# EAGLE design Nu6551 (EAGLE 7.7.0)
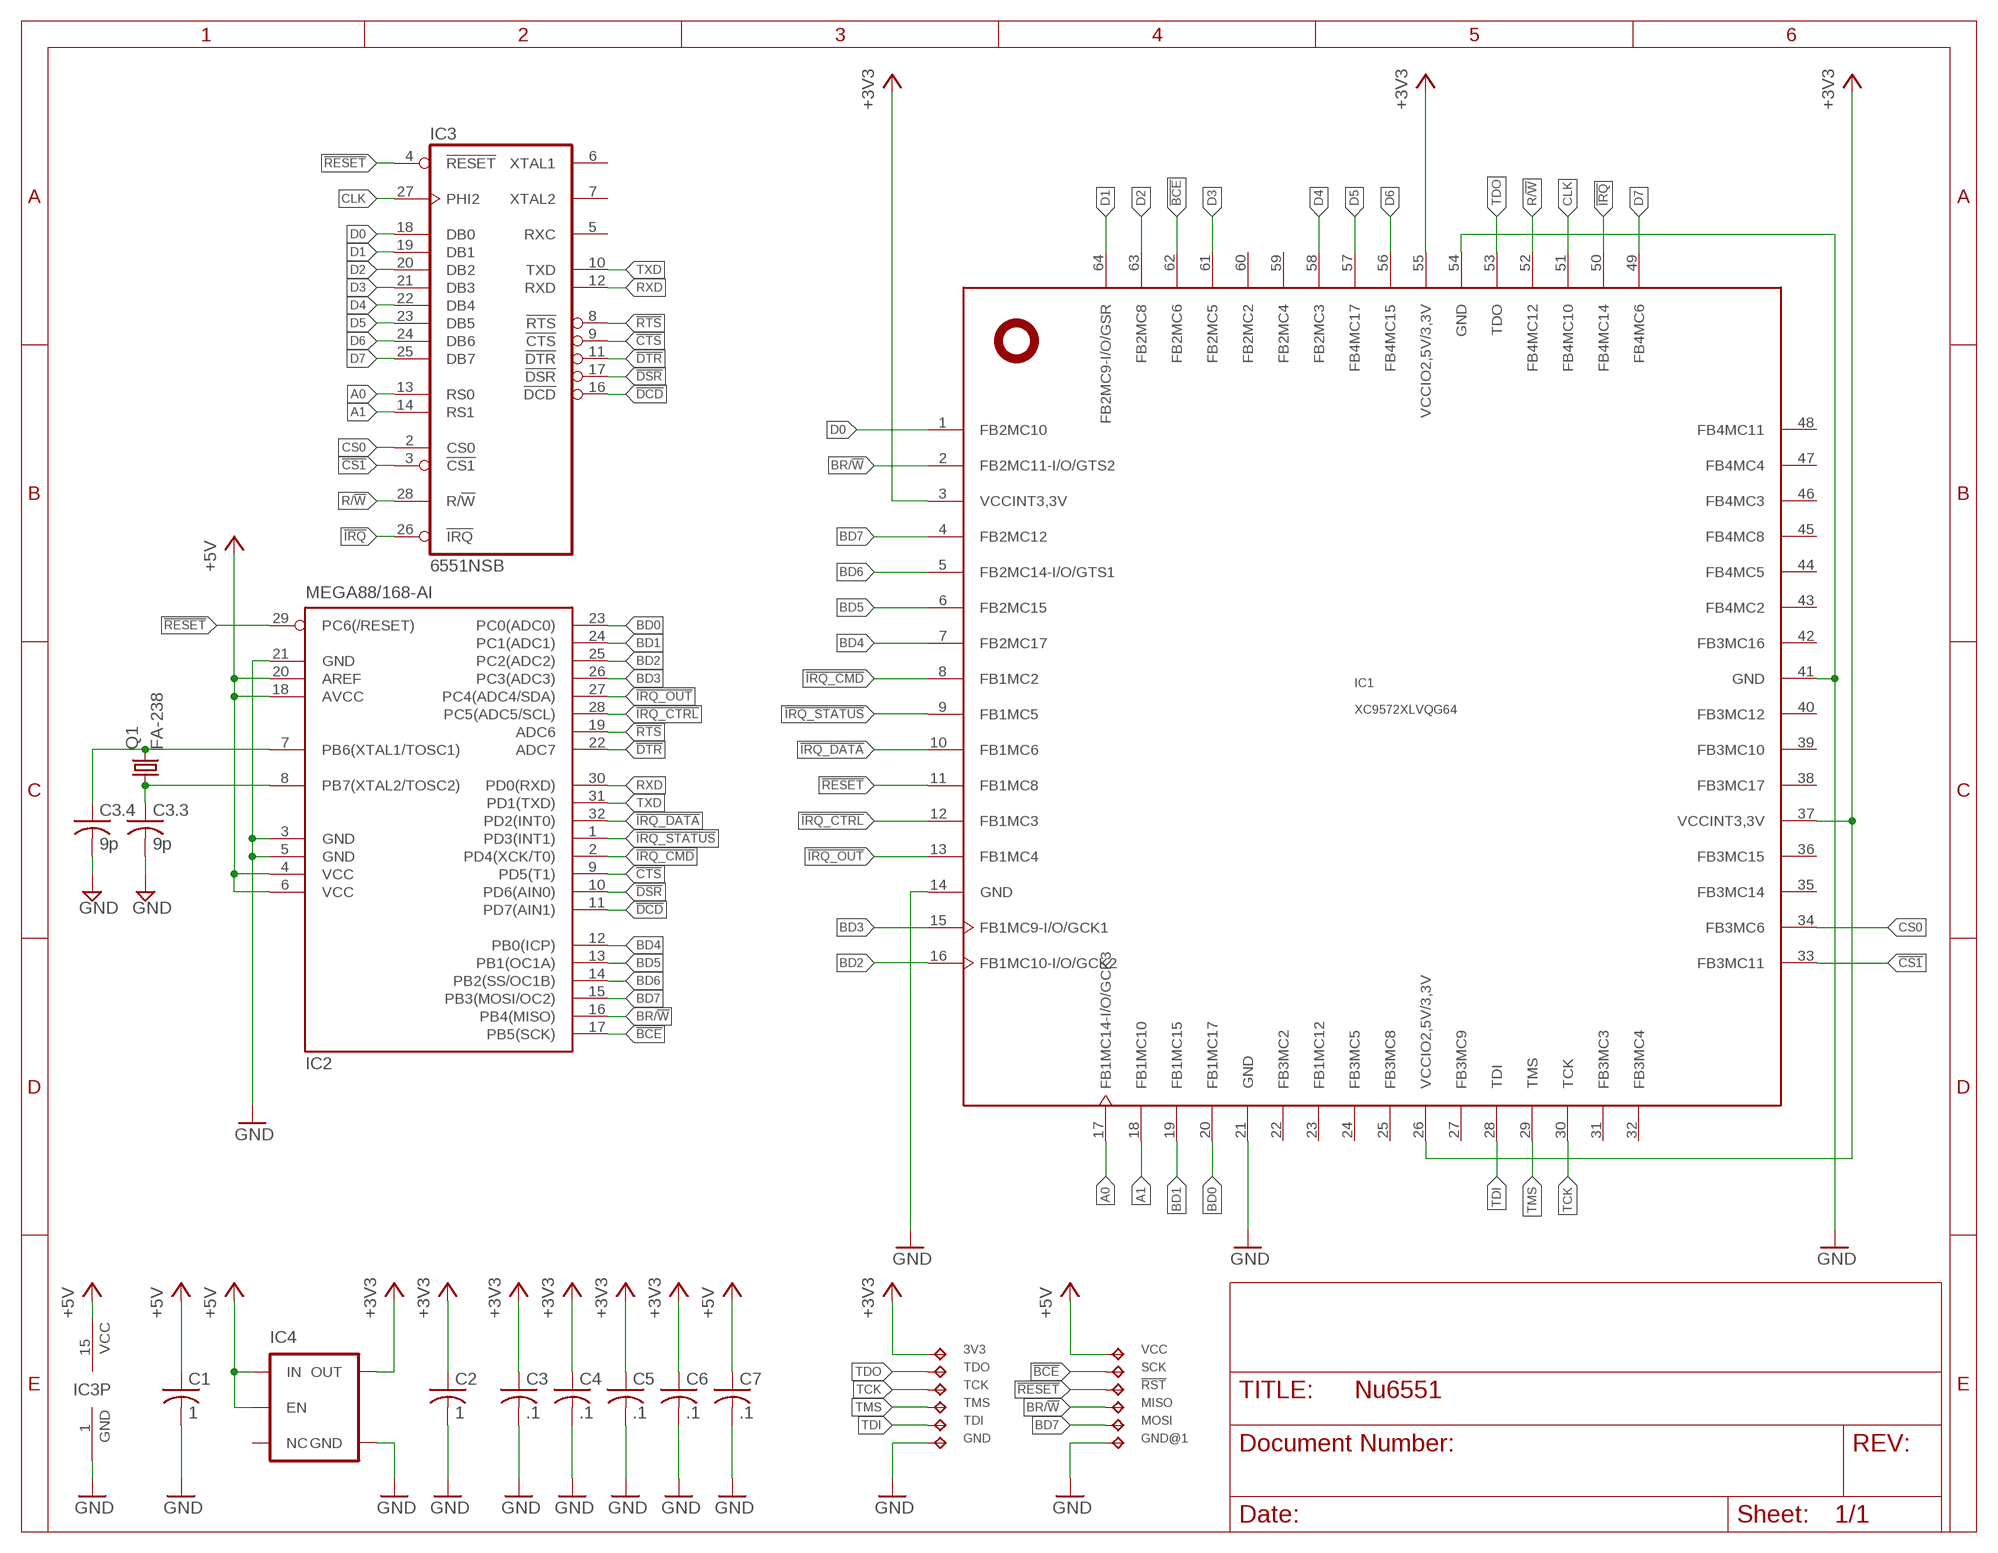
[diagram p0: schematic, sheet 1]

## Parts
3V3  TPTP10R  [TP10R]
!RST  TPTP10R  [TP10R]
C1  1  C-USC0402  [C0402]
C2  1  C-USC0402  [C0402]
C3  .1  C-USC0402  [C0402]
C3.3  9p  C-USC0402  [C0402]
C3.4  9p  C-USC0402  [C0402]
C4  .1  C-USC0402  [C0402]
C5  .1  C-USC0402  [C0402]
C6  .1  C-USC0402  [C0402]
C7  .1  C-USC0402  [C0402]
GND  TPTP10R  [TP10R]
GND@1  TPTP10R  [TP10R]
IC1  XC9572XLVQG64  [VQFP64]
IC2  MEGA88/168-AI  MEGA8-AI  [TQFP32-08]
IC3  6551NSB  [DIL28-SMD-REVERSE]
IC4  V_REG_TPS76433SOT23-5  [SOT23-5]
MISO  TPTP10R  [TP10R]
MOSI  TPTP10R  [TP10R]
Q1  FA-238  [ASE]
SCK  TPTP10R  [TP10R]
TCK  TPTP10R  [TP10R]
TDI  TPTP10R  [TP10R]
TDO  TPTP10R  [TP10R]
TMS  TPTP10R  [TP10R]
VCC  TPTP10R  [TP10R]

## Nets
!BCE: IC1.62(FB2MC6) IC2.17(PB5(SCK)) SCK.TP
!CS1: IC1.33(FB3MC11) IC3.3(!CS1)
!CTS: IC2.9(PD5(T1)) IC3.9(!CTS)
!DCD: IC2.11(PD7(AIN1)) IC3.16(!DCD)
!DSR: IC2.10(PD6(AIN0)) IC3.17(!DSR)
!DTR: IC2.22(ADC7) IC3.11(!DTR)
!IRQ: IC1.50(FB4MC14) IC3.26(!IRQ)
!IRQ_CMD: IC1.8(FB1MC2) IC2.2(PD4(XCK/T0))
!IRQ_CTRL: IC1.12(FB1MC3) IC2.28(PC5(ADC5/SCL))
!IRQ_DATA: IC1.10(FB1MC6) IC2.32(PD2(INT0))
!IRQ_OUT: IC1.13(FB1MC4) IC2.27(PC4(ADC4/SDA))
!IRQ_STATUS: IC1.9(FB1MC5) IC2.1(PD3(INT1))
!RESET: !RST.TP IC1.11(FB1MC8) IC2.29(PC6(/RESET)) IC3.4(!RESET)
!RTS: IC2.19(ADC6) IC3.8(!RTS)
+3V3: 3V3.TP C2.1 C3.1 C4.1 C5.1 C6.1 IC1.3(VCCINT3,3V) IC1.26(VCCIO2,5V/3,3V) IC1.37(VCCINT3,3V) IC1.55(VCCIO2,5V/3,3V) IC4.5(OUT)
+5V: C1.1 C7.1 IC2.4(VCC) IC2.6(VCC) IC2.18(AVCC) IC2.20(AREF) IC3.15(VCC) IC4.1(IN) IC4.3(EN) VCC.TP
A0: IC1.17(FB1MC14-I/O/GCK3) IC3.13(RS0)
A1: IC1.18(FB1MC10) IC3.14(RS1)
BD0: IC1.20(FB1MC17) IC2.23(PC0(ADC0))
BD1: IC1.19(FB1MC15) IC2.24(PC1(ADC1))
BD2: IC1.16(FB1MC10-I/O/GCK2) IC2.25(PC2(ADC2))
BD3: IC1.15(FB1MC9-I/O/GCK1) IC2.26(PC3(ADC3))
BD4: IC1.7(FB2MC17) IC2.12(PB0(ICP))
BD5: IC1.6(FB2MC15) IC2.13(PB1(OC1A))
BD6: IC1.5(FB2MC14-I/O/GTS1) IC2.14(PB2(SS/OC1B))
BD7: IC1.4(FB2MC12) IC2.15(PB3(MOSI/OC2)) MOSI.TP
BR/!W: IC1.2(FB2MC11-I/O/GTS2) IC2.16(PB4(MISO)) MISO.TP
CLK: IC1.51(FB4MC10) IC3.27(PHI2)
CS0: IC1.34(FB3MC6) IC3.2(CS0)
D0: IC1.1(FB2MC10) IC3.18(DB0)
D1: IC1.64(FB2MC9-I/O/GSR) IC3.19(DB1)
D2: IC1.63(FB2MC8) IC3.20(DB2)
D3: IC1.61(FB2MC5) IC3.21(DB3)
D4: IC1.58(FB2MC3) IC3.22(DB4)
D5: IC1.57(FB4MC17) IC3.23(DB5)
D6: IC1.56(FB4MC15) IC3.24(DB6)
D7: IC1.49(FB4MC6) IC3.25(DB7)
GND: C1.2 C2.2 C3.2 C3.3.2 C3.4.2 C4.2 C5.2 C6.2 C7.2 GND.TP GND@1.TP IC1.14(GND) IC1.21(GND) IC1.41(GND) IC1.54(GND) IC2.3(GND) IC2.5(GND) IC2.21(GND) IC3.1(GND) IC4.2(GND)
N$6: C3.3.1 IC2.8(PB7(XTAL2/TOSC2)) Q1.1
N$9: C3.4.1 IC2.7(PB6(XTAL1/TOSC1)) Q1.3
R/!W: IC1.52(FB4MC12) IC3.28(R/!W)
RXD: IC2.30(PD0(RXD)) IC3.12(RXD)
TCK: IC1.30(TCK) TCK.TP
TDI: IC1.28(TDI) TDI.TP
TDO: IC1.53(TDO) TDO.TP
TMS: IC1.29(TMS) TMS.TP
TXD: IC2.31(PD1(TXD)) IC3.10(TXD)
Unconnected: IC1.22(FB3MC2) IC1.23(FB1MC12) IC1.24(FB3MC5) IC1.25(FB3MC8) IC1.27(FB3MC9) IC1.31(FB3MC3) IC1.32(FB3MC4) IC1.35(FB3MC14) IC1.36(FB3MC15) IC1.38(FB3MC17) IC1.39(FB3MC10) IC1.40(FB3MC12) IC1.42(FB3MC16) IC1.43(FB4MC2) IC1.44(FB4MC5) IC1.45(FB4MC8) IC1.46(FB4MC3) IC1.47(FB4MC4) IC1.48(FB4MC11) IC1.59(FB2MC4) IC1.60(FB2MC2) IC3.5(RXC) IC3.6(XTAL1) IC3.7(XTAL2) IC4.4(NC)

## Power pins joined to a net without a drawn wire
GND: Q1.2(GND) Q1.4(GND)

## Library data of the parts
3V3 !RST GND GND@1 MISO MOSI SCK TCK TDI TDO TMS VCC = testpad:TP: Test pad
C1 C2 = resistor:C-US: CAPACITOR, American symbol
C3 C3.3 C3.4 C4-C7 = rcl:C-US: CAPACITOR, American symbol
IC1 = xilinx_xc95XXXxl:XC9572XLVQG64
IC2 = atmel:MEGA8: MICROCONTROLLER 8 Kbytes FLASH, 1 kbytes SRAM, 512 bytes EEPROM, USART, 6-channel 10 bit ADC, 2-channel 8 bit ADC Pin compatible with Atmega48, ATMega88, ATMega168 Source: avr.lbr; MPN: ATMEGA8-16AU; OC_FARNELL: 9171371; OC_NEWARK: 73M8863
IC3 = commodore:65*51: ACIA. Capable of RS-232
IC4 = SparkFun:V_REG_TPS76433: Voltage Regulator Older TI part. LDO 150mA regulator. No output by-pass cap option. See V_REG_LDO for a better part.
Q1 = crystal-jlb:FA-238

## Board
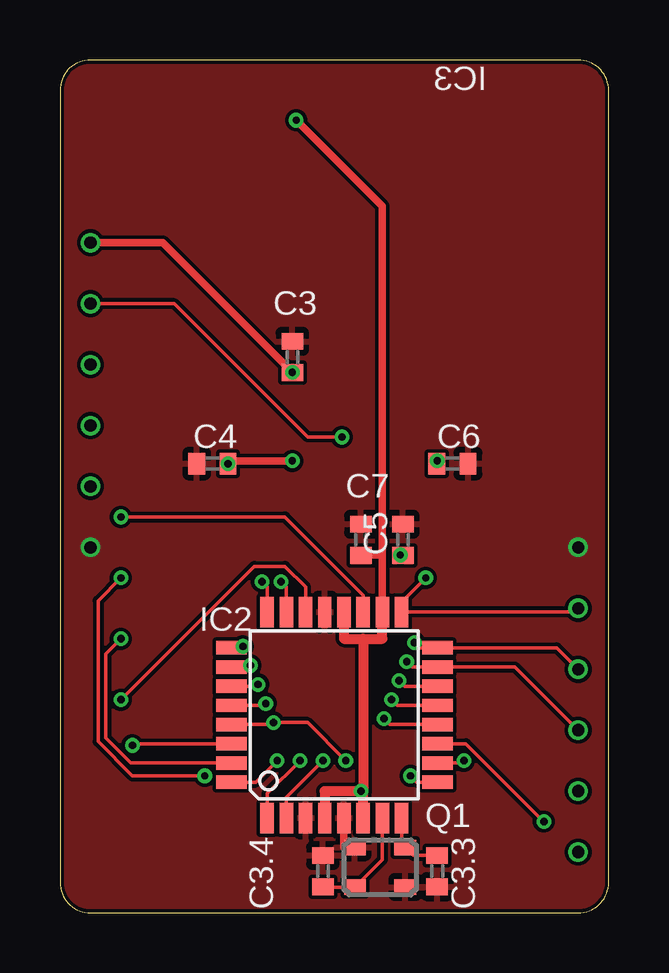
[diagram p1: board, top side]
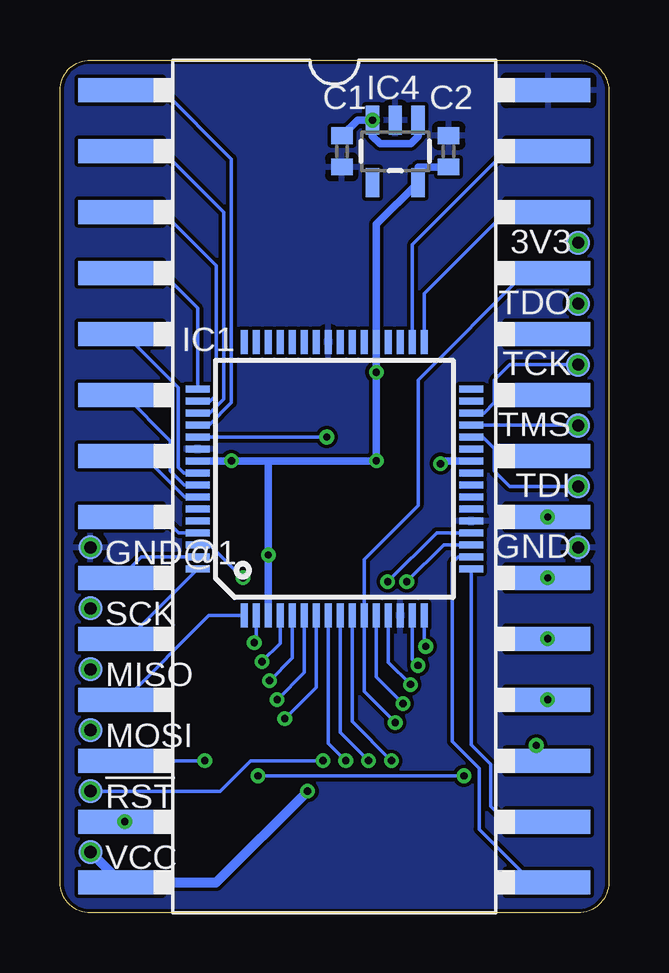
[diagram p2: board, bottom side, seen from below]

Size 22.86 x 35.56 mm. Coordinates in mm from the lower left corner, seen from the top.
Outline: 0,34.29 0,1.27 arc90 1.27,0 21.59,0 arc90 22.86,1.27 22.86,34.29 arc90 21.59,35.56 1.27,35.56 arc90 0,34.29
Copper layers (1*16): Top 0.035mm / dielectric 1.5mm / Bottom 0.035mm
Design rules "hackvana *": minimum track width 6mil, minimum drill 0.3mm, track to track 6mil, track to pad 6mil, pad to pad 6mil, via to via 6mil, smd to smd 0mil, copper to edge 6mil, drill to drill 6mil, minimum pad ring 10mil, minimum via ring 6mil, stop-mask expansion 2mil, vias tented up to drill 100mil, thermal gap 10mil

### Footprints (pad centres in the part's own frame; a part is rotated, then mirrored left to right if it is on the bottom)
TP10R = smd 1 x 1: TP 0,0
C0402 = smd 0.7 x 0.9: 1 -0.65,0; 2 0.65,0
VQFP64 = smd 1 x 0.3: 1 -5.7,3.75; 2 -5.7,3.25; 3 -5.7,2.75; 4 -5.7,2.25; 5 -5.7,1.75; 6 -5.7,1.25; 7 -5.7,0.75; 8 -5.7,0.25; 9 -5.7,-0.25; 10 -5.7,-0.75; 11 -5.7,-1.25; 12 -5.7,-1.75; 13 -5.7,-2.25; 14 -5.7,-2.75; 15 -5.7,-3.25; 16 -5.7,-3.75; 33 5.7,-3.75; 34 5.7,-3.25; 35 5.7,-2.75; 36 5.7,-2.25; 37 5.7,-1.75; 38 5.7,-1.25; 39 5.7,-0.75; 40 5.7,-0.25; 41 5.7,0.25; 42 5.7,0.75; 43 5.7,1.25; 44 5.7,1.75; 45 5.7,2.25; 46 5.7,2.75; 47 5.7,3.25; 48 5.7,3.75 | smd 0.3 x 1: 17 -3.75,-5.7; 18 -3.25,-5.7; 19 -2.75,-5.7; 20 -2.25,-5.7; 21 -1.75,-5.7; 22 -1.25,-5.7; 23 -0.75,-5.7; 24 -0.25,-5.7; 25 0.25,-5.7; 26 0.75,-5.7; 27 1.25,-5.7; 28 1.75,-5.7; 29 2.25,-5.7; 30 2.75,-5.7; 31 3.25,-5.7; 32 3.75,-5.7; 49 3.75,5.7; 50 3.25,5.7; 51 2.75,5.7; 52 2.25,5.7; 53 1.75,5.7; 54 1.25,5.7; 55 0.75,5.7; 56 0.25,5.7; 57 -0.25,5.7; 58 -0.75,5.7; 59 -1.25,5.7; 60 -1.75,5.7; 61 -2.25,5.7; 62 -2.75,5.7; 63 -3.25,5.7; 64 -3.75,5.7
TQFP32-08 = smd 1.27 x 0.559: 1 -4.293,2.8; 2 -4.293,2; 3 -4.293,1.2; 4 -4.293,0.4; 5 -4.293,-0.4; 6 -4.293,-1.2; 7 -4.293,-2; 8 -4.293,-2.8; 17 4.293,-2.8; 18 4.293,-2; 19 4.293,-1.2; 20 4.293,-0.4; 21 4.293,0.4; 22 4.293,1.2; 23 4.293,2; 24 4.293,2.8 | smd 0.559 x 1.27: 9 -2.8,-4.293; 10 -2,-4.293; 11 -1.2,-4.293; 12 -0.4,-4.293; 13 0.4,-4.293; 14 1.2,-4.293; 15 2,-4.293; 16 2.8,-4.293; 25 2.8,4.293; 26 2,4.293; 27 1.2,4.293; 28 0.4,4.293; 29 -0.4,4.293; 30 -1.2,4.293; 31 -2,4.293; 32 -2.8,4.293
DIL28-SMD-REVERSE = smd 1 x 3.5 bottom: 1 -16.51,-8.92; 2 -13.97,-8.92; 3 -11.43,-8.92; 4 -8.89,-8.92; 5 -6.35,-8.92; 6 -3.81,-8.92; 7 -1.27,-8.92; 8 1.27,-8.92; 9 3.81,-8.92; 10 6.35,-8.92; 11 8.89,-8.92; 12 11.43,-8.92; 13 13.97,-8.92; 14 16.51,-8.92; 15 16.51,8.92; 16 13.97,8.92; 17 11.43,8.92; 18 8.89,8.92; 19 6.35,8.92; 20 3.81,8.92; 21 1.27,8.92; 22 -1.27,8.92; 23 -3.81,8.92; 24 -6.35,8.92; 25 -8.89,8.92; 26 -11.43,8.92; 27 -13.97,8.92; 28 -16.51,8.92
SOT23-5 = smd 0.55 x 1.2: 1 -0.95,-1.3; 2 0,-1.3; 3 0.95,-1.3; 4 0.95,1.3; 5 -0.95,1.3
ASE = smd 0.9 x 0.65: 1 -1.05,-0.825; 2 1.05,-0.825; 3 1.05,0.825; 4 -1.05,0.825

### Placement (x,y rotation side)
3V3  1.27,27.94 0 bottom
!RST  21.59,5.08 0 bottom
C1  11.11,31.75 270 bottom
C2  6.67,31.75 90 bottom
C3  9.68,23.18 90 top
C3.3  15.72,1.75 270 top
C3.4  10.95,1.75 90 top
C4  6.35,18.73 180 top
C5  14.29,15.56 90 top
C6  16.35,18.73 0 top
C7  12.54,15.56 90 top
GND  1.27,15.24 0 bottom
GND@1  21.59,15.24 0 bottom
IC1  11.43,18.1 90 bottom
IC2  11.43,8.26 90 top
IC3  11.43,17.78 270 top
IC4  8.89,31.75 180 bottom
MISO  21.59,10.16 0 bottom
MOSI  21.59,7.62 0 bottom
Q1  13.33,1.91 180 top
SCK  21.59,12.7 0 bottom
TCK  1.27,22.86 0 bottom
TDI  1.27,17.78 0 bottom
TDO  1.27,25.4 0 bottom
TMS  1.27,20.32 0 bottom
VCC  21.59,2.54 0 bottom

### Tracks (layer width: path | path; a pad name or v marks a point on that pad's centre or on a via)
!BCE  (via drill 0.3, 0.51)
  Top 0.152: SCK.TP 21.44,12.55 IC2.17 14.23,12.96 v15.24,13.97
  Bottom 0.152: IC1.62 16.62,15.35 v15.24,13.97
  other vias: 21.59,12.7
!CS1
  Bottom 0.152: IC3.3 4.29,29.21 7.68,25.82 IC1.33
!CTS  (via drill 0.3)
  Top 0.152: v2.54,13.97 1.59,13.02 1.59,7.14 3.02,5.71 v6.03,5.71 | v14.61,5.71 14.87,5.46 IC2.9
  Bottom 0.152: v14.61,5.71 v6.03,5.71 | IC3.9 v2.54,13.97
!DCD  (via drill 0.3)
  Top 0.152: IC2.11 16.92,7.05 v20.16,3.81
  Bottom 0.152: 20,3.81 IC3.16 v20.16,3.81
!DSR  (via drill 0.3)
  Top 0.152: v16.83,6.35 16.73,6.25 IC2.10
  Bottom 0.152: IC3.17 v16.83,6.35
!DTR  (via drill 0.3)
  Top 0.152: IC2.22 10.23,13.58 9.37,14.45 8.1,14.45 v2.54,8.89
  Bottom 0.152: IC3.11 v2.54,8.89
!IRQ
  Bottom 0.152: IC3.26 18.57,29.21 16.35,26.99 16.35,21.59 16.59,21.35 IC1.50
!IRQ_CMD  (via drill 0.3)
  Top 0.152: IC2.2 9.43,4.83 v10.95,6.35
  Bottom 0.152: IC1.8 11.68,7.08 v10.95,6.35
!IRQ_CTRL  (via drill 0.3)
  Top 0.152: IC2.28 8.5,8.65 v8.57,8.73
  Bottom 0.152: IC1.12 9.68,9.84 v8.57,8.73
!IRQ_DATA  (via drill 0.3)
  Top 0.152: IC2.32 8.15,5.46 v9.05,6.35
  Bottom 0.152: v9.05,6.35 10.68,7.98 IC1.10
!IRQ_OUT  (via drill 0.3)
  Top 0.152: IC2.27 8.18,9.46 v8.25,9.53
  Bottom 0.152: IC1.13 9.18,10.45 v8.25,9.53
!IRQ_STATUS  (via drill 0.3)
  Top 0.152: IC2.1 8.63,4.98 v10,6.35
  Bottom 0.152: IC1.9 11.18,7.53 v10,6.35
!RESET  (via drill 0.3, 0.51)
  Top 0.152: IC2.29 8.81,7.86 v8.89,7.94 10.32,7.94 v11.91,6.35
  Bottom 0.152: !RST.TP 16.19,5.08 14.92,6.35 v11.91,6.35 | v8.89,7.94 10.18,9.23 IC1.11 10.18,14.74 7.94,16.99 7.94,22.23 3.49,26.67 IC3.4
  other vias: 21.59,5.08
!RTS  (via drill 0.3)
  Top 0.152: v2.54,16.51 9.37,16.51 12.63,13.25 IC2.19
  Bottom 0.152: IC3.8 v2.54,16.51
+3V3  (via drill 0.3, 0.51)
  Top 0.305: v9.68,18.85 7.11,18.85 | 7.11,18.85 7,18.85 C4.1 7.11,18.85 | C6.1 15.75,18.85 v15.72,18.85 | C3.1 v9.68,22.54 4.28,27.94 3V3.TP | C5.1 14.3,14.92 v14.18,14.92
  Bottom 0.305: C2.1 7.94,31.1 IC4.5 9.68,28.71 IC1.37 v9.68,22.54 | v9.68,22.54 v9.68,18.85 14.18,18.85 | IC1.55 v15.72,18.85 14.18,18.85 | IC1.3 v14.18,14.92 14.18,18.85 | IC1.26 7,18.85 C4.1 | v9.68,22.54 9.68,22.38
  other vias: 1.27,27.94 7,18.73
+5V  (via drill 0.3, 0.51)
  Top 0.305: IC4.3 13.43,29.46 13.43,14.92 | 13.43,14.92 IC2.18 | C7.1 12.56,14.92 13.43,14.92
  Top 0.406: IC2.20 11.83,11.43 12.63,11.43 | 12.63,11.43 13.43,11.43 IC2.18 | IC2.6 12.63,5.08 | 12.63,5.08 v12.54,5.08 11.03,5.08 IC2.4 | 12.63,11.43 12.63,5.08
  Bottom 0.305: IC4.1 7.94,32.38 8.25,32.07 9.53,32.07 9.84,32.38 | IC4.3 9.84,32.55 9.84,32.54 9.84,32.38 | C1.1 10.46,33.05 IC4.3 | IC4.3 9.84,32.38
  Bottom 0.406: VCC.TP 20.35,1.3 IC3.15 16.35,1.27 v12.54,5.08
  other vias: 21.59,2.54 9.84,33.05
A0
  Bottom 0.152: IC1.17 5.73,7 4.92,6.19 4.92,4.45 4.29,3.81 IC3.13
A1
  Bottom 0.152: IC1.18 6.27,14.85 6.51,14.61 6.51,7.14 5.4,6.03 5.4,3.49 3.17,1.27 IC3.14
BD0  (via drill 0.3)
  Top 0.152: v9.21,13.81 9.43,13.59 IC2.23
  Bottom 0.152: IC1.20 7.17,15.85 v9.21,13.81
BD1  (via drill 0.3)
  Top 0.152: v8.41,13.81 8.63,13.6 IC2.24
  Bottom 0.152: IC1.19 6.88,15.35 v8.41,13.81
BD2  (via drill 0.3)
  Top 0.152: IC2.25 7.56,11.05 v7.62,11.11
  Bottom 0.152: IC1.16 7.68,11.17 v7.62,11.11
BD3  (via drill 0.3)
  Top 0.152: IC2.26 7.87,10.26 v7.94,10.32
  Bottom 0.152: IC1.15 8.18,10.56 v7.94,10.32
BD4  (via drill 0.3)
  Top 0.152: IC2.12 13.73,7.86 v13.49,8.1
  Bottom 0.152: IC1.7 12.18,9.41 v13.49,8.1
BD5  (via drill 0.3)
  Top 0.152: IC2.13 14.05,8.65 v13.81,8.89
  Bottom 0.152: IC1.6 12.68,10.02 v13.81,8.89
BD6  (via drill 0.3)
  Top 0.152: IC2.14 14.36,9.46 v14.13,9.68
  Bottom 0.152: IC1.5 13.18,10.63 v14.13,9.68
BD7  (via drill 0.3, 0.51)
  Top 0.152: MOSI.TP 18.95,10.26 IC2.15 14.67,10.26 v14.45,10.48
  Bottom 0.152: IC1.4 13.68,11.24 v14.45,10.48
  other vias: 21.59,7.62
BR/!W  (via drill 0.3, 0.51)
  Top 0.152: MISO.TP 20.7,11.05 IC2.16 14.98,11.05 v14.76,11.27
  Bottom 0.152: v14.76,11.27 14.68,11.36 IC1.2
  other vias: 21.59,10.16
CLK
  Bottom 0.152: IC3.27 18.57,31.75 16.03,29.21 16.03,21.43 16.62,20.85 IC1.51
CS0
  Bottom 0.152: IC3.2 4.29,31.75 8.18,27.86 IC1.34
D0
  Bottom 0.152: IC3.18 20.16,8.89 16.65,12.4 IC1.1
D1
  Bottom 0.152: IC1.64 20.05,11.43 IC3.19
D2
  Bottom 0.152: IC3.20 19.47,14.85 IC1.63
D3
  Bottom 0.152: IC1.61 17.91,15.85 18.57,16.51 IC3.21
D4
  Bottom 0.152: IC3.22 19.37,19.05 17.66,17.35 IC1.58
D5
  Bottom 0.152: IC3.23 20.16,21.59 18.26,19.68 18.26,18.41 17.69,17.85 IC1.57
D6
  Bottom 0.152: IC3.24 20.16,24.13 17.94,21.91 17.94,18.57 17.71,18.35 IC1.56
D7
  Bottom 0.152: IC3.25 18.57,26.67 17.13,25.23 IC1.49
GND  (via drill 0.51)
  Top 0.305: IC2.5 11.83,2.73 Q1.2
  other vias: 1.27,15.24 21.59,15.24
  pour Bottom: 22.86,34.29 22.86,1.27 arc-90 21.59,0 1.27,0 arc-90 0,1.27 0,34.29 arc-90 1.27,35.56 21.59,35.56 arc-90
  pour Top: 22.86,34.29 22.86,1.27 arc-90 21.59,0 1.27,0 arc-90 0,1.27 0,34.29 arc-90 1.27,35.56 21.59,35.56 arc-90
N$6
  Top 0.152: IC2.8 14.23,2.88 Q1.1 14.72,2.4 C3.3.1
N$9
  Top 0.152: C3.4.1 10.97,1.08 Q1.3 13.43,2.23 IC2.7
R/!W
  Bottom 0.152: IC3.28 18.57,34.29 15.72,31.43 15.72,21.27 16.64,20.35 IC1.52
RXD  (via drill 0.3)
  Top 0.152: v3.02,6.99 3.09,7.05 IC2.30
  Bottom 0.152: v3.02,6.99 2.51,6.48 IC3.12
TCK  (via drill 0.51)
  Bottom 0.152: IC1.30 5.19,20.85 4.76,21.27 4.76,22.23 4.13,22.86 TCK.TP
  other vias: 1.27,22.86
TDI  (via drill 0.51)
  Bottom 0.152: IC1.28 5.24,19.85 4.76,19.37 4.76,18.41 4.13,17.78 TDI.TP
  other vias: 1.27,17.78
TDO  (via drill 0.3, 0.51)
  Top 0.152: v11.75,19.84 10.32,19.84 4.76,25.4 TDO.TP
  Bottom 0.152: IC1.53 v11.74,19.85 v11.75,19.84
  other vias: 1.27,25.4
TMS  (via drill 0.51)
  Bottom 0.152: IC1.29 1.4,20.35 1.37,20.32 TMS.TP
  other vias: 1.27,20.32
TXD  (via drill 0.3)
  Top 0.152: v2.54,11.43 1.9,10.79 1.9,7.3 2.95,6.25 IC2.31
  Bottom 0.152: IC3.10 v2.54,11.43